# Altium schematic sheet Audio_codec.SchDoc
size A4; SheetNumber: 11; SheetTotal: 18
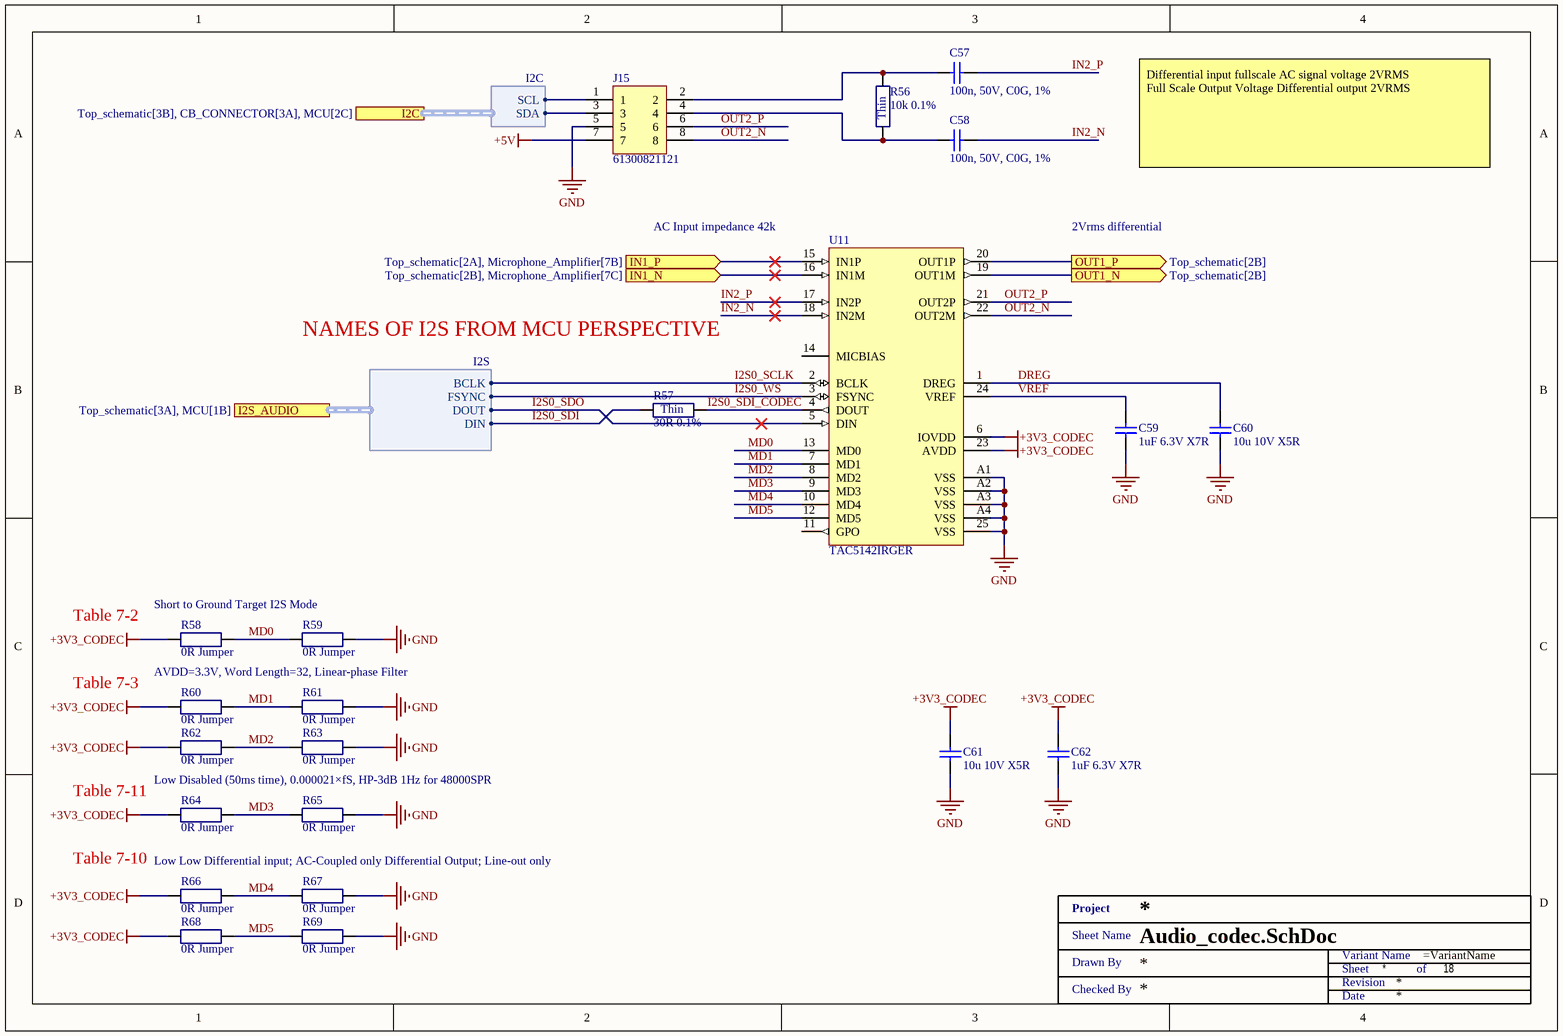
[diagram p0: Audio_codec.SchDoc]

## Parts
C57  100n, 50V, C0G, 1%  [SMD1206]
C58  100n, 50V, C0G, 1%  [SMD1206]
C59  1uF 6.3V X7R  [SMD0402]
C60  10u 10V X5R  [SMD0603]
C61  10u 10V X5R  [SMD0603]
C62  1uF 6.3V X7R  [SMD0402]
J15  61300821121  [61300821121]
R56  10k 0.1%  [SMD0402 - R]
R57  30R 0.1%  [SMD0402 - R]
R58  0R Jumper  [SMD0402 - R]
R59  0R Jumper  [SMD0402 - R]
R60  0R Jumper  [SMD0402 - R]
R61  0R Jumper  [SMD0402 - R]
R62  0R Jumper  [SMD0402 - R]
R63  0R Jumper  [SMD0402 - R]
R64  0R Jumper  [SMD0402 - R]
R65  0R Jumper  [SMD0402 - R]
R66  0R Jumper  [SMD0402 - R]
R67  0R Jumper  [SMD0402 - R]
R68  0R Jumper  [SMD0402 - R]
R69  0R Jumper  [SMD0402 - R]
U11  TAC5142IRGER  [QFN50P400X400X75_HS-29M]
XX?  Title 1  (value not drawn)  (graphical)

## Ports
I2C (harness I2C, see Top_schematic[3B], CB_CONNECTOR[3A], MCU[2C]), I2S_AUDIO (harness I2S, see Top_schematic[3A], MCU[1B]), IN1_N (in, see Top_schematic[2B], Microphone_Amplifier[7C]), IN1_P (in, see Top_schematic[2A], Microphone_Amplifier[7B]), OUT1_N (out, see Top_schematic[2B]), OUT1_P (out, see Top_schematic[2B])

## Harnesses
I2S: BCLK, FSYNC, DOUT, DIN
I2C: SCL, SDA

## Nets
+3V3_CODEC: C61.2 C62.2 R58.1 R60.1 R62.1 R64.1 R66.1 R68.1 U11.6(IOVDD) U11.23(AVDD)
+5V: J15.7
GND: C59.1 C60.1 C61.1 C62.1 J15.5 R59.2 R61.2 R63.2 R65.2 R67.2 R69.2 U11.25(VSS) U11.A1(VSS) U11.A2(VSS) U11.A3(VSS) U11.A4(VSS)
DREG: C60.2 U11.1(DREG)
I2S0_SCLK: U11.2(BCLK) ; port I2S_AUDIO.BCLK
I2S0_SDI: R57.1 ; port I2S_AUDIO.DIN
I2S0_SDI_CODEC: R57.2 U11.4(DOUT)
I2S0_SDO: U11.5(DIN) ; port I2S_AUDIO.DOUT
I2S0_WS: U11.3(FSYNC) ; port I2S_AUDIO.FSYNC
IN1_N: U11.16(IN1M) ; port IN1_N
IN1_P: U11.15(IN1P) ; port IN1_P
IN2_N: C58.2 U11.18(IN2M)
IN2_P: C57.2 U11.17(IN2P)
MD0: R58.2 R59.1 U11.13(MD0)
MD1: R60.2 R61.1 U11.7(MD1)
MD2: R62.2 R63.1 U11.8(MD2)
MD3: R64.2 R65.1 U11.9(MD3)
MD4: R66.2 R67.1 U11.10(MD4)
MD5: R68.2 R69.1 U11.12(MD5)
OUT1_N: U11.19(OUT1M) ; port OUT1_N
OUT1_P: U11.20(OUT1P) ; port OUT1_P
OUT2_N: J15.8 U11.22(OUT2M)
OUT2_P: J15.6 U11.21(OUT2P)
VREF: C59.2 U11.24(VREF)
NetC57_1: C57.1 J15.2 R56.2
NetC58_1: C58.1 J15.4 R56.1
NetJ15_1: J15.1 ; port I2C.SCL
NetJ15_3: J15.3 ; port I2C.SDA

Not connected (* = marked no-connect by the designer): U11 11(GPO) 14(MICBIAS)

## Notes on the sheet
- Differential input fullscale AC signal voltage 2VRMS
  Full Scale Output Voltage Differential output 2VRMS
- (near U11) AC Input impedance 42k
- 2Vrms differential
- NAMES OF I2S FROM MCU PERSPECTIVE
- (near R58) Table 7-2
- Short to Ground Target I2S Mode
- Table 7-3
- AVDD=3.3V, Word Length=32, Linear-phase Filter
- Low Disabled (50ms time), 0.000021×fS, HP-3dB 1Hz for 48000SPR
- Table 7-11
- Table 7-10
- Low Low Differential input; AC-Coupled only Differential Output; Line-out only
- (in symbol TC0225B300JTCC) Thin
- (in symbol TC0225B1002TCC) Thin
- (in symbol Title 1) Project; Sheet Name; Variant Name; Drawn By; Sheet; of; Revision; Checked By; Date

## Library data of the parts
C57 C58 = GCM31C5C1H104FA16L: CAP CER 0.1UF 50V C0G/NP0 1206 1%; Manufacturer: Murata; Supplier 1: Mouser; Supplier Part Number 1: 81-GCM31C5C1H104FA16; Manufacturer Part Number: GCM31C5C1H104FA16L; RoHS: No; Stock 1: 9381; Pricing 1: 1=1,24000, 10=0,98200, 25=0,90100, 100=0,73700, 250=0,59000, 500=0,55700 (USD); Supplier 2: Digi-Key; Supplier Part Number 2: 490-GCM31C5C1H104FA16LCT-ND; Supplier 3: Future Electronics; Supplier Part Number 3: GCM31C5C1H104FA16L-CUTT; Capacitance: 100n
C59 C62 = TCC0402X7R105K6R3AT: Capacitor: MLCC; SMD; 0402; 1µF; 6.3V; ±10%; X7R; CCTC; Capacitance: 1u; Supplier 1: LCSC; Supplier Part Number 1: C5448871; Manufacturer: CCTC; Manufacturer Part Number: TCC0402X7R105K6R3AT; Category: Ceramic Capacitors; Stock 1: 242350; Pricing 1: 50=0.0089, 500=0.0072, 1500=0.0063, 10000=0.0058, 20000=0.0053, 50000=0.005 (USD); ComponentLink1URL: https://datasheet.octopart.com:443/TCC0402X7R105K6R3AT-CCTC-datasheet-194166649.pdf?src-supplier=LCSC; ComponentLink1Description: https://datasheet.octopart.com:443/TCC0402X7R105K6R3AT-CCTC-datasheet-194166649.pdf?src-supplier=LCSC; ComponentLink2URL: https://datasheet.octopart.com:443/TCC0402X7R105K6R3AT-CCTC-datasheet-192317456.pdf?src-supplier=HQonline; ComponentLink2Description: https://datasheet.octopart.com:443/TCC0402X7R105K6R3AT-CCTC-datasheet-192317456.pdf?src-supplier=HQonline
C60 C61 = TCC0603X5R106K100CT: Multilayer Ceramic Capacitor (MLCC) 10uF ±10% 10V X5R 0603 SMD, CCTC TCC Series; Capacitance: 10u; Supplier 1: LCSC; Supplier Part Number 1: C380314
J15 = 61300821121: CONN HEADER DUAL 8 POS 2.54; Manufacturer: Wurth Electronics; Number of Positions: 8; Gender: Male; Connector Type: Male Pin; Pitch: 0.1inch; Supplier 1: Mouser; Supplier Part Number 1: 710-61300821121; Manufacturer Part Number: 61300821121; RoHS: Yes; Category: Connectors; Stock 1: 1828; Pricing 1: 1=0,66000, 10=0,55700, 50=0,38700, 100=0,35200, 1000=0,32000, 10000=0,32000 (USD); Mount: Through Hole; Contact Plating: Gold; Contact Material: Copper; Color: Black; Number of Rows: 2; Packaging: Bulk; Termination: Solder; Number of Contacts: 8; Row Spacing: 0.1inch; Contact Mating Length: 0.236inch; REACH SVHC: Unknown; Lead Free: Lead Free; ComponentLink1URL: https://datasheet.ciiva.com/28505/1442180-28505510.pdf?src-supplier=Element14; ComponentLink1Description: https://datasheet.ciiva.com/28505/1442180-28505510.pdf?src-supplier=Element14; Supplier 2: Farnell; Supplier Part Number 2: 2356133; Supplier 3: Digi-Key; Supplier Part Number 3: 732-5296-ND
R56 = TC0225B1002TCC: Fixed Resistor, Thin Film, 0.0625W, 10000ohm, 50V, 0.1% +/-Tol, Surface Mount, 0402; Manufacturer: Uniroyal; Power Rating: 62.5mW; Supplier 1: LCSC; Supplier Part Number 1: C2989267; Manufacturer Part Number: TC0225B1002TCC; Category: Chip SMD Resistors; Stock 1: 10200; Pricing 1: 20=0.0396, 200=0.0352, 600=0.0327, 2000=0.0312, 10000=0.0299, 20000=0.0292 (USD); Case/Package: 0402; Composition: Thin Film; Export Control Classification Number (ECCN) Code: EAR99; Height: 300µm; Harmonized Tariff Schedule (HTS) Code: 8533.21.00.30; Length: 1mm; Lifecycle Status: Production; Max Operating Temperature: 155°C; Min Operating Temperature: -55°C; Mounting Technology: Surface Mount; Number of Terminals: 2; Resistance: 10k; Tolerance: 0.1%; Width: 500µm; Working Voltage: 50V; ComponentLink1URL: https://datasheet.octopart.com:443/TC0225B1002TCC-Uniroyal-datasheet-194228365.pdf?src-supplier=LCSC; ComponentLink1Description: https://datasheet.octopart.com:443/TC0225B1002TCC-Uniroyal-datasheet-194228365.pdf?src-supplier=LCSC
R57 = TC0225B300JTCC: Resistor: thin film; SMD; 0402; 30Ω; 62.5mW; ±0.1%; TC25; 25V; -55÷155°C; Manufacturer: Uniroyal; Supplier 1: LCSC; Supplier Part Number 1: C50670254; Manufacturer Part Number: TC0225B300JTCC; Category: Uncategorized; Stock 1: 4950; Pricing 1: 50=0.0203, 500=0.0161, 1500=0.0137, 10000=0.0123, 20000=0.0111, 50000=0.0104 (USD); ComponentLink1URL: https://datasheet.octopart.com:443/TC0225B300JTCC-Uniroyal-datasheet-194228366.pdf?src-supplier=LCSC; ComponentLink1Description: https://datasheet.octopart.com:443/TC0225B300JTCC-Uniroyal-datasheet-194228366.pdf?src-supplier=LCSC; Resistance: 30R
R58-R69 = HQ02WAF0000TCE: Resistor: thick film / jumper; SMD; 0402; 0Ω; 100mW; max 50V; -55÷155°C; UNI-ROYAL; Manufacturer: Uniroyal; Supplier 1: LCSC; Supplier Part Number 1: C2791314; Manufacturer Part Number: HQ02WAF0000TCE; Category: Uncategorized; Stock 1: 5900; Pricing 1: 100=0.0059, 1000=0.0051, 3000=0.0047, 10000=0.0045, 50000=0.0043 (USD); ComponentLink1URL: https://datasheet.octopart.com:443/HQ02WAF0000TCE-Uniroyal-datasheet-194224146.pdf?src-supplier=LCSC; ComponentLink1Description: https://datasheet.octopart.com:443/HQ02WAF0000TCE-Uniroyal-datasheet-194224146.pdf?src-supplier=LCSC; Resistance: 0R
U11 = TAC5142IRGER: Hardware-control stereo audio codec with 103dB dynamic range ADC and 110dB dynamic range DAC 24-VQFN -40 to 125; Manufacturer: Texas Instruments; Manufacturer Lifecycle Status: ACTIVE; Manufacturer Part Number: TAC5142IRGER; RoHS: Compliant; Category: Integrated Circuits (ICs); Stock 1: 2850; Pricing 1: 1=6.3, 10=4.51, 50=4.2, 100=3.7, 1000=2.65, 10000=2.55 (USD); Case/Package: VQFN; Height: 1mm; Length: 4mm; Lifecycle Status: Production; Pins: 24; Thickness: 880µm; Width: 4mm; ComponentLink1URL: https://octopart.com:443/opatz8j6/c1?t=YFSsGmLZcXWbdqrMCLw25IWqAw6k9gFxKaNNOU5wJ5U63vvZS52iNskDVgOi5J4xgN5KPzz--1Njgko23HC53B69eB64g8FSkhDhHzGcD5KrituH4jgy77dM-s58_KmxCpoQqfF3HD_-yEwyGTjuiWHTsoXT1jS6pbZW4ctduK_uBwCqcvg92laEZnnqk2ukOUJzEU_frpK-cKVjuCpImP142kfOHwqxOwJpnik2TleQTesp86vGKR9pXa9aRFl2yx8nE5VZPK63oTyjnrLMYY5u2TyYQKW-RDyaHeJHA47OtZuaK3EW5H8MrGTYhH6hOo8E_w7nwzwe9whMRXrdGLOrV0dO_iTP6E8jlXzXlsxlojXu9U5dgL4fqUxWv1fEEkGW8wt7&src-supplier=Texas+Instruments; ComponentLink1Description: https://octopart.com:443/opatz8j6/c1?t=YFSsGmLZcXWbdqrMCLw25IWqAw6k9gFxKaNNOU5wJ5U63vvZS52iNskDVgOi5J4xgN5KPzz--1Njgko23HC53B69eB64g8FSkhDhHzGcD5KrituH4jgy77dM-s58_KmxCpoQqfF3HD_-yEwyGTjuiWHTsoXT1jS6pbZW4ctduK_uBwCqcvg92laEZnnqk2ukOUJzEU_frpK-cKVjuCpImP142kfOHwqxOwJpnik2TleQTesp86vGKR9pXa9aRFl2yx8nE5VZPK63oTyjnrLMYY5u2TyYQKW-RDyaHeJHA47OtZuaK3EW5H8MrGTYhH6hOo8E_w7nwzwe9whMRXrdGLOrV0dO_iTP6E8jlXzXlsxlojXu9U5dgL4fqUxWv1fEEkGW8wt7&src-supplier=Texas+Instruments; ComponentLink2URL: http://sigma.octopart.com:80/reach_statement/Texas-Instruments-company-64.pdf?src-supplier=Compliance+Statements; ComponentLink2Description: http://sigma.octopart.com:80/reach_statement/Texas-Instruments-company-64.pdf?src-supplier=Compliance+Statements; ComponentLink3URL: http://sigma.octopart.com:80/conflict_mineral_statement/Texas-Instruments-company-63.pdf?src-supplier=Compliance+Statements; ComponentLink3Description: http://sigma.octopart.com:80/conflict_mineral_statement/Texas-Instruments-company-63.pdf?src-supplier=Compliance+Statements; Supplier 1: Mouser; Supplier Part Number 1: 595-TAC5142IRGER; Supplier 2: LCSC; Supplier Part Number 2: C43656746